# EAGLE design board (EAGLE 9.6.2)

## Sheet 1 of 2
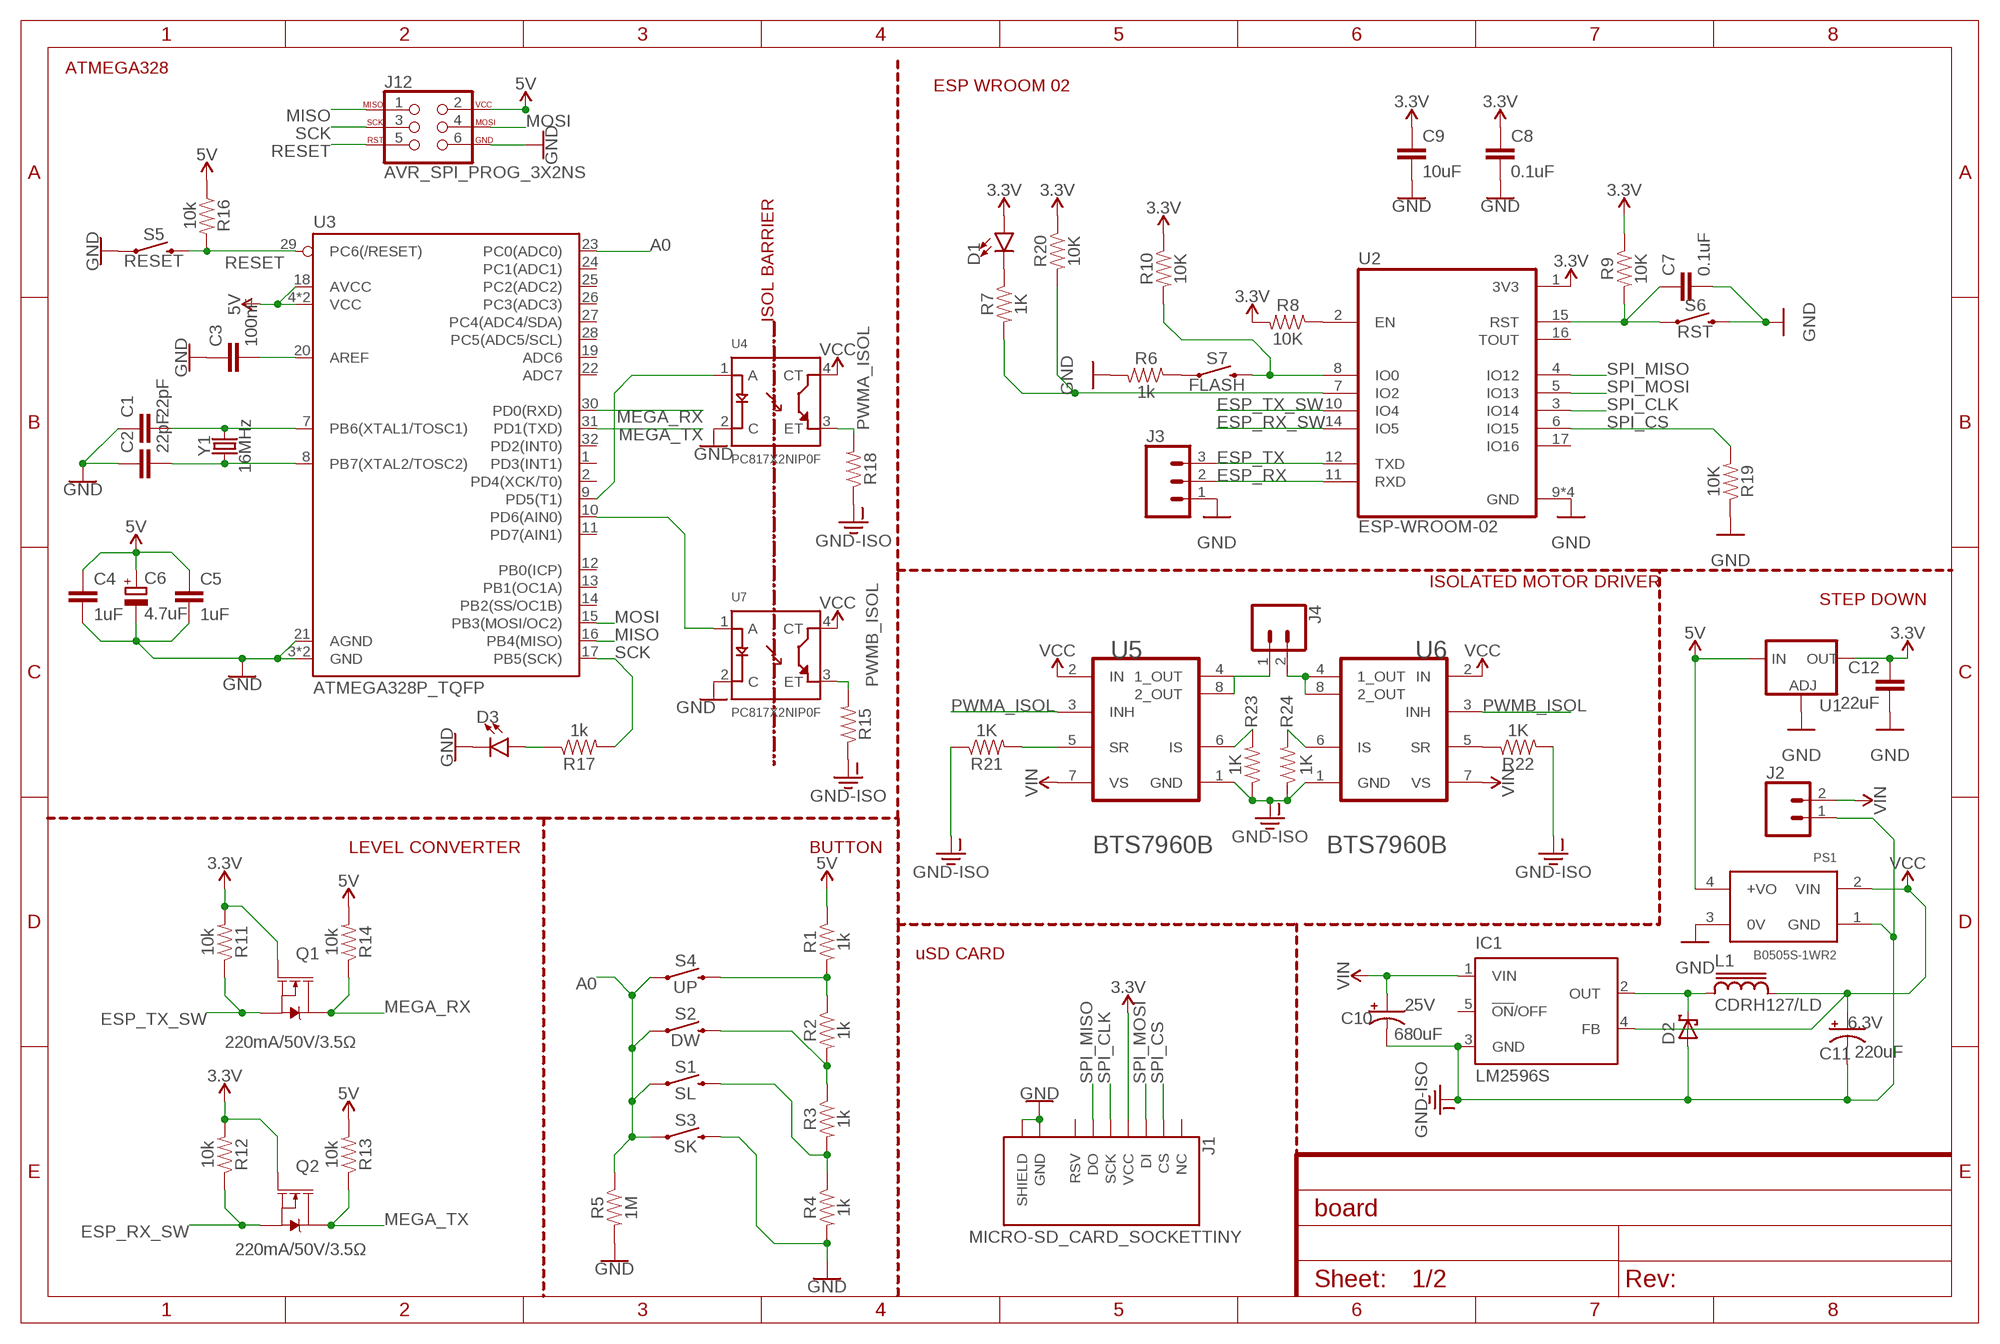
[diagram p0: schematic, sheet 1]

### Parts
C1  22pF  22PF-0603-50V-5%  [0603]
C2  22pF  22PF-0603-50V-5%  [0603]
C3  100nF  C-EUC0805  [C0805]
C4  1uF  C-EUC0805  [C0805]
C5  1uF  C-EUC0805  [C0805]
C6  4.7uF  CPOL-EUUD-4X5,8  [UD-4X5,8_NICHICON]
C7  0.1uF  0.1UF-0603-25V-5%  [0603]
C8  0.1uF  0.1UF-0603-25V-5%  [0603]
C9  10uF  0.1UF-0603-25V-5%  [0603]
C10  680uF  CPOL-USE5-10.5  [E5-10,5]
C11  220uF  CPOL-USUD-6,3X5,8  [UD-6,3X5,8_NICHICON]
C12  22uF  22UF-0805-6.3V-20%  [0805]
D1  LED1206  [LED-1206]
D2  SCHOTTKY-DIODESMD  [SMB]
D3  LED1206  [LED-1206]
IC1  LM2596S  [TO263-5]
J1  MICRO-SD_CARD_SOCKETTINY  [MICROSD_TINY]
J2  CONN_025MM  [SCREWTERMINAL-5MM-2]
J3  CONN_03POLAR  [MOLEX-1X3]
J4  CONN_025MM  [SCREWTERMINAL-5MM-2]
J12  AVR_SPI_PROG_3X2NS  [2X3-NS]
L1  CDRH127/LD  [CDRH127/LD]
PS1  B0505S-1WR2  [CONV_B0505S-1WR2]
Q1  220mA/50V/3.5Ω  MOSFET-NCH-BSS138  [SOT23-3]
Q2  220mA/50V/3.5Ω  MOSFET-NCH-BSS138  [SOT23-3]
R1  1k  RESISTOR1206  [1206]
R2  1k  RESISTOR1206  [1206]
R3  1k  RESISTOR1206  [1206]
R4  1k  RESISTOR1206  [1206]
R5  1M  RESISTOR1206  [1206]
R6  1k  RESISTOR1206  [1206]
R7  1K  RESISTOR1206  [1206]
R8  10K  RESISTOR1206  [1206]
R9  10K  RESISTOR1206  [1206]
R10  10K  RESISTOR1206  [1206]
R11  10k  RESISTOR1206  [1206]
R12  10k  RESISTOR1206  [1206]
R13  10k  RESISTOR1206  [1206]
R14  10k  RESISTOR1206  [1206]
R15  RESISTOR1206  [1206]
R16  10k  RESISTOR1206  [1206]
R17  1k  RESISTOR1206  [1206]
R18  RESISTOR1206  [1206]
R19  10K  RESISTOR1206  [1206]
R20  10K  RESISTOR1206  [1206]
R21  1K  RESISTOR1206  [1206]
R22  1K  RESISTOR1206  [1206]
R23  1K  RESISTOR1206  [1206]
R24  1K  RESISTOR1206  [1206]
S1  SL  MOMENTARY-SWITCH-SPST-SMD-5.2-REDUNDANT  [TACTILE_SWITCH_SMD_5.2MM]
S2  DW  MOMENTARY-SWITCH-SPST-SMD-5.2-REDUNDANT  [TACTILE_SWITCH_SMD_5.2MM]
S3  SK  MOMENTARY-SWITCH-SPST-SMD-5.2-REDUNDANT  [TACTILE_SWITCH_SMD_5.2MM]
S4  UP  MOMENTARY-SWITCH-SPST-SMD-5.2-REDUNDANT  [TACTILE_SWITCH_SMD_5.2MM]
S5  RESET  MOMENTARY-SWITCH-SPST-SMD-5.2-REDUNDANT  [TACTILE_SWITCH_SMD_5.2MM]
S6  RST  MOMENTARY-SWITCH-SPST-SMD-5.2-REDUNDANT  [TACTILE_SWITCH_SMD_5.2MM]
S7  FLASH  MOMENTARY-SWITCH-SPST-SMD-5.2-REDUNDANT  [TACTILE_SWITCH_SMD_5.2MM]
U1  V_REG_LM1117SOT223  [SOT223]
U2  ESP-WROOM-02  [MODULE_ESP-WROOM-02]
U3  ATMEGA328P_TQFP  [TQFP32-08]
U4  PC817X2NIP0F  [SOT254P975X400-4N]
U5  INFINEON_BTS7960BINFINEON_BTS7960B_0_2  [INFINEON_BTS7960B_2]
U6  INFINEON_BTS7960BINFINEON_BTS7960B_0_2  [INFINEON_BTS7960B_2]
U7  PC817X2NIP0F  [SOT254P975X400-4N]
Y1  16MHz  CRYSTALPTH-HC49US  [HC49US]

### Nets
3.3V: C8.1 C9.1 C12.1 D1.A J1.4(VCC) Q1.1(G) Q2.1(G) R8.2 R9.1 R10.1 R11.2 R12.2 R20.1 U1.2(OUT) U1.4(OUT) U2.1(3V3)
5V: C4.1 C5.1 C6.+ J12.2 PS1.4(+VO) R1.1 R13.2 R14.2 R16.1 U1.3(IN) U3.4(VCC) U3.6(VCC) U3.18(AVCC)
A0: R5.1 S1.1 S1.2 S2.1 S2.2 S3.1 S3.2 S4.1 S4.2 U3.23(PC0(ADC0))
ESP_RX: J3.2 U2.11(RXD)
ESP_RX_SW: Q2.2(S) R12.1 U2.14(IO5)
ESP_TX: J3.3 U2.12(TXD)
ESP_TX_SW: Q1.2(S) R11.1 U2.10(IO4)
GND: C1.1 C2.1 C3.1 C4.2 C5.2 C6.- C7.2 C8.2 C9.2 C12.2 D3.C J1.6(GND) J1.GND1(SHIELD) J1.GND2(SHIELD) J1.GND3(SHIELD) J1.GND4(SHIELD) J1.GND5(SHIELD) J1.GND6(SHIELD) J3.1 J12.6 PS1.3(0V) R4.2 R5.2 R6.2 R19.1 S3.3 S3.4 S5.1 S5.2 S6.3 S6.4 U1.1(ADJ) U2.9(GND) U2.13(GND) U2.18(GND) U2.19(GND) U3.3(GND) U3.5(GND) U3.21(AGND) U4.2(C) U7.2(C)
GND-ISO: C10.- C11.- D2.A IC1.3(GND) J2.1 PS1.1(GND) R15.1 R18.1 R21.1 R22.2 R23.1 R24.1 U5.1(GND) U6.1(GND)
MEGA_RX: Q1.3(D) R14.1 U3.30(PD0(RXD))
MEGA_TX: Q2.3(D) R13.1 U3.31(PD1(TXD))
MISO: J12.1 U3.16(PB4(MISO))
MOSI: J12.4 U3.15(PB3(MOSI/OC2))
N$1: C1.2 U3.7(PB6(XTAL1/TOSC1)) Y1.2
N$2: C2.2 U3.8(PB7(XTAL2/TOSC2)) Y1.1
N$3: R2.2 R3.1 S2.3 S2.4
N$4: R3.2 R4.1 S1.3 S1.4
N$5: R1.2 R2.1 S4.3 S4.4
N$7: R23.2 U5.6(IS)
N$8: C7.1 R9.2 S6.1 S6.2 U2.15(RST)
N$9: R24.2 U6.6(IS)
N$10: R10.2 S7.3 S7.4 U2.8(IO0)
N$11: R6.1 S7.1 S7.2
N$12: J4.1 U5.4(1_OUT) U5.8(2_OUT)
N$13: D1.C R7.1
N$14: R8.1 U2.2(EN)
N$21: J4.2 U6.4(1_OUT) U6.8(2_OUT)
N$22: R21.2 U5.5(SR)
N$23: R7.2 R20.2 U2.7(IO2)
N$24: R22.1 U6.5(SR)
N$42: D3.A R17.1
N$43: C3.2 U3.20(AREF)
OUT: D2.C IC1.2(OUT) L1.1
PWMA: U3.9(PD5(T1)) U4.1(A)
PWMA_ISOL: R18.2 U4.3(ET) U5.3(INH)
PWMB: U3.10(PD6(AIN0)) U7.1(A)
PWMB_ISOL: R15.2 U6.3(INH) U7.3(ET)
RESET: J12.5 R16.2 S5.3 S5.4 U3.29(PC6(/RESET))
SCK: J12.3 R17.2 U3.17(PB5(SCK))
SPI_CLK: J1.5(SCK) U2.3(IO14)
SPI_CS: J1.2(CS) R19.2 U2.6(IO15)
SPI_MISO: J1.7(DO) U2.4(IO12)
SPI_MOSI: J1.3(DI) U2.5(IO13)
VCC: C11.+ IC1.4(FB) L1.2 PS1.2(VIN) U4.4(CT) U5.2(IN) U6.2(IN) U7.4(CT)
VIN: C10.+ IC1.1(VIN) J2.2 U5.7(VS) U6.7(VS)
Unconnected: IC1.5(!ON!/OFF) J1.1(RSV) J1.8(RSV) J1.9(NC) U2.16(TOUT) U2.17(IO16) U3.1(PD3(INT1)) U3.2(PD4(XCK/T0)) U3.11(PD7(AIN1)) U3.12(PB0(ICP)) U3.13(PB1(OC1A)) U3.14(PB2(SS/OC1B)) U3.19(ADC6) U3.22(ADC7) U3.24(PC1(ADC1)) U3.25(PC2(ADC2)) U3.26(PC3(ADC3)) U3.27(PC4(ADC4/SDA)) U3.28(PC5(ADC5/SCL)) U3.32(PD2(INT0))

### Notes on the sheet
- ATMEGA328
- ESP WROOM 02
- ISOL BARRIER
- ISOLATED MOTOR DRIVER
- STEP DOWN
- LEVEL CONVERTER | BUTTON
- uSD CARD

## Sheet 2 of 2

## Library data of the parts
C1 C2 = SparkFun-Capacitors:22PF: 22pF ceramic capacitors A capacitor is a passive two-terminal electrical component used to store electrical energy temporarily in an electric field.; PROD_ID: CAP-07876
C3-C5 = rcl:C-EU: CAPACITOR, European symbol; SPICEPREFIX: C
C6 = rcl:CPOL-EU: POLARIZED CAPACITOR, European symbol; SPICEPREFIX: C
C7 C8 = SparkFun-Capacitors:0.1UF: 0.1µF ceramic capacitors A capacitor is a passive two-terminal electrical component used to store electrical energy temporarily in an electric field.; PROD_ID: CAP-08604
C9 = SparkFun-Capacitors:0.1UF: 0.1µF ceramic capacitors A capacitor is a passive two-terminal electrical component used to store electrical energy temporarily in an electric field.; PROD_ID: CAP-08604; VALUE: 0.1uF
C10 = rcl:CPOL-US: POLARIZED CAPACITOR, American symbol; VOLTAGE: 25V
C11 = rcl:CPOL-US: POLARIZED CAPACITOR, American symbol; VOLTAGE: 6.3V
C12 = SparkFun-Capacitors:22UF: 22µF ceramic capacitors A capacitor is a passive two-terminal electrical component used to store electrical energy temporarily in an electric field.; PROD_ID: CAP-08402
D1 D3 = SparkFun-LED:LED: LED (Generic) Standard schematic elements and footprints for 5mm, 3mm, 1206, and 0603 sized LEDs. Generic LEDs with no color specified.
D2 = diode:SCHOTTKY-DIODE: Schottky Diode
IC1 = national-semiconductor:LM2596: SIMPLE SWITCHER® Power Converter 150 kHz 3A Step-Down Voltage Regulator Source: http://www.national.com/ds/LM/LM2596.pdf; MF: NATIONAL SEMICONDUCTOR; MPN: LM2596S-ADJ/NOPB; OC_FARNELL: 9494367; OC_NEWARK: 41K3842
J1 = SparkFun-Connectors:MICRO-SD_CARD_SOCKET: microSD Socket for Transflash Push-push type µSD socket. tDoc lines correctly indicate media card edge positions when inserting (unlocked, locked, depressed). NOTE: CD1 and CD2 are connected internally, and the default detect state of the socket is detect pin to ground. SparkFun Products: WAV Trigger <https://www.sparkfun.com/products/13660> CAN-Bus Shield <https://www.sparkfun.com/products/13262> SparkFun Level Shifing microSD Breakout <https://www.sparkfun.com/products/13743>; PROD_ID: CONN-13500
J2 J4 = SparkFun-Connectors:CONN_02: Multi connection point. Often used as Generic Header-pin footprint for 0.1 inch spaced/style header connections On any of the 0.1 inch spaced packages, you can populate with these: Break Away Headers - Straight <https://www.sparkfun.com/products/116> (PRT-00116) Break Away Male Headers - Right Angle <https://www.sparkfun.com/products/553> (PRT-00553) Female Headers <https://www.sparkfun.com/products/115> (PRT-00115) Break Away Headers - Machine Pin <https://www.sparkfun.com/products/117> (PRT-00117) Break Away Female Headers - Swiss Machine Pin <https://www.sparkfun.com/products/743> (PRT-00743) For SCREWTERMINALS and SPRING TERMINALS visit here: Screw Terimnals on SparkFun.com <https://www.sparkfun.com/search/results?term=Screw+Terminals> (5mm/3.5mm/2.54mm spacing) This device is also useful as a general connection point to wire up your design to another part of your project. Our various solder wires solder well into these plated through hole pads. Hook-Up Wire - Assortment (Stranded, 22 AWG) <https://www.sparkfun.com/products/11375> (PRT-11375) Hook-Up Wire - Assortment (Solid Core, 22 AWG) <https://www.sparkfun.com/products/11367> (PRT-11367) View the entire wire category on our website here <https://www.sparkfun.com/categories/141> Special notes: Molex polarized connector foot print use with: PRT-08233 with associated crimp pins and housings. 2.54_SCREWTERM for use with PRT-10571. 3.5mm Screw Terminal footprints for PRT-08084 5mm Screw Terminal footprints for use with PRT-08432; SF_SKU: PRT-08432
J3 = SparkFun-Connectors:CONN_03: Multi connection point. Often used as Generic Header-pin footprint for 0.1 inch spaced/style header connections On any of the 0.1 inch spaced packages, you can populate with these: Break Away Headers - Straight <https://www.sparkfun.com/products/116> (PRT-00116) Break Away Male Headers - Right Angle <https://www.sparkfun.com/products/553> (PRT-00553) Female Headers <https://www.sparkfun.com/products/115> (PRT-00115) Break Away Headers - Machine Pin <https://www.sparkfun.com/products/117> (PRT-00117) Break Away Female Headers - Swiss Machine Pin <https://www.sparkfun.com/products/743> (PRT-00743) Stackable Header - 3 Pin (Female, 0.1") <https://www.sparkfun.com/products/13875> (PRT-13875) For SCREWTERMINALS and SPRING TERMINALS visit here: Screw Terimnals on SparkFun.com <https://www.sparkfun.com/search/results?term=Screw+Terminals> (5mm/3.5mm/2.54mm spacing) This device is also useful as a general connection point to wire up your design to another part of your project. Our various solder wires solder well into these plated through hole pads. Hook-Up Wire - Assortment (Stranded, 22 AWG) <https://www.sparkfun.com/products/11375> (PRT-11375) Hook-Up Wire - Assortment (Solid Core, 22 AWG) <https://www.sparkfun.com/products/11367> (PRT-11367) View the entire wire category on our website here <https://www.sparkfun.com/categories/141> Special notes: Molex polarized connector foot print use with SKU : PRT-08232 with associated crimp pins and housings.; PROD_ID: CONN-08625; SF_ID: PRT-08096
J12 = SparkFun-Connectors:AVR_SPI_PROG_3X2: AVR ISP 6 Pin This is the reduced ISP connector for AVR programming. Common on Arduino. This footprint will take up less PCB space and can be used with a 10-pin to 6-pin adapter such as SKU: BOB-08508 **Special note about "TEST_POINT" package. The stop mask is on the top side, so if you want your programming test points to be on the bottom of your board, make sure to place this package on the bottom side of the board. This also ensure that the orientation to program from the bottom side will be correct. SparkFun Products: SparkFun ISP Pogo Adapter <https://www.sparkfun.com/products/11591> - NS Tiny AVR Programmer <https://www.sparkfun.com/products/11801> -PTH
L1 = inductor-sumida:CDRH127/LD: Power Inductor
PS1 = B0505S-1WR2:B0505S-1WR2: 1W isolated DC-DC with Fixed Input Voltage; unregulated Single Output Buy Part <https://snapeda.com/parts/B0505S-1WR2/MORNSUN/view-part/?ref=eda>; AVAILABILITY: Warning; DESCRIPTION: 1W isolated DC-DC with Fixed Input Voltage; unregulated Single Output; MF: MORNSUN; MP: B0505S-1WR2; PACKAGE: None; PRICE: None
Q1 Q2 = SparkFun-DiscreteSemi:MOSFET-NCH: N-channel MOSFETs Voltage controlled devices that allow control of high current outputs. SparkFun Products: SparkFun OpenScale <https://www.sparkfun.com/products/13261> SparkFun Digital Sandbox <https://www.sparkfun.com/products/12651> SparkFun Monster Moto Shield <https://www.sparkfun.com/products/10182> SparkFun MOSFET Power Controller <https://www.sparkfun.com/products/11214>; PROD_ID: TRANS-00830
R1-R24 = SparkFun-Resistors:RESISTOR: Generic Resistor Package
S1-S7 = SparkFun-Switches:MOMENTARY-SWITCH-SPST: Momentary Switch (Pushbutton) - SPST Normally-open (NO) SPST momentary switches (buttons, pushbuttons). Variants PTH-12MM - 12mm square, through-hole Momentary Pushbutton Switch - 12mm Square <https://www.sparkfun.com/products/9190> (COM-09190) PTH-6.0MM, PTH-6.0MM-KIT - 6.0mm square, through-hole Mini Pushbutton Switch <https://www.sparkfun.com/products/97> (COM-00097) KIT package intended for soldering kit's - only one side of pads' copper is exposed. PTH-RIGHT-ANGLE-KIT - Right-angle, through-hole Right Angle Tactile Button <https://www.sparkfun.com/products/10791> - Used on SparkFun BigTime Watch Kit <https://www.sparkfun.com/products/11734> SMD-12MM - 12mm square, surface-mount Tactile Button - SMD (12mm) <https://www.sparkfun.com/products/12993> (COM-12993) Used on SparkFun PicoBoard <https://www.sparkfun.com/products/11888> SMD-4.5MM - 4.5mm Square Trackball Switch Used on SparkFun Blackberry Trackballer Breakout <https://www.sparkfun.com/products/13169> SMD-4.6MMX2.8MM - 4.60mm x 2.80mm, surface mount Used on SparkFun SAMD21 Mini Breakout <https://www.sparkfun.com/products/13664> SMD-5.2MM, SMD-5.2-REDUNDANT - 5.2mm square, surface-mount Mini Pushbutton Switch - SMD <https://www.sparkfun.com/products/8720> (COM-08720) Used on Arduino Pro Mini <https://www.sparkfun.com/products/11114> REDUNDANT package connects both switch circuits together SMD-6.0X3.5MM - 6.0 x 3.5mm, surface mount Momentary Reset Switch SMD <https://www.sparkfun.com/products/8229> (COM-08229) SMD-6.2MM-TALL - 6.2mm square, surface mount Tactile Button - SMD (6mm) <https://www.sparkfun.com/products/12992> Used on SparkFun Digital Sandbox <https://www.sparkfun.com/products/12651> SMD-RIGHT-ANGLE - Right-angle, surface mount Used on SparkFun Block for Intel® Edison - Arduino <https://www.sparkfun.com/products/13036>; PROD_ID: SWCH-08247; SF_SKU: COM-08720
U1 = SparkFun-IC-Power:V_REG_LM1117: Voltage Regulator LM1117 Standard adjustable voltage regulator but in SMD form. Spark Fun Electronics SKU : COM-00595; PROD_ID: VREG-08170
U2 = ESP-WROOM-02:ESP-WROOM-02: Wi-Fi Module w/ESP8266 802.11b/g/n 20dBm 20x18x3mm; AVAILABILITY: Unavailable; DESCRIPTION: WiFi 802.11b/g/n Transceiver Module 2.4GHz ~ 2.5GHz Integrated, Trace Surface Mount; MF: Espressif Systems; MP: ESP-WROOM-02; PACKAGE: SMD-18 Espressif Systems; PRICE: None
U3 = SparkFun-IC-Microcontroller:ATMEGA328P_TQFP: Popular 328P in QFP Storefront component: ATmega328 - TQFP <https://www.sparkfun.com/products/13448> (COM-13448) Datasheet <http://www.sparkfun.com/datasheets/Components/SMD/ATMega328.pdf> SparkFun Products SparkFun RedBoard - Programmed with Arduino <https://www.sparkfun.com/products/12757> (DEV-12757) Arduino Pro Mini 328 - 5V/16MHz <https://www.sparkfun.com/products/11113> (DEV-11113) Arduino Pro Mini 328 - 3.3V/8MHz <https://www.sparkfun.com/products/11114> (DEV-11114) SparkFun OpenLog <https://www.sparkfun.com/products/13712> (DEV-13712) SparkFun MicroView - OLED Arduino Module <https://www.sparkfun.com/products/12923> (DEV-12923) SparkFun Digital Sandbox <https://www.sparkfun.com/products/12651> (DEV-12651) SparkFun PicoBoard <https://www.sparkfun.com/products/11888> (WIG-11888) Arduino Fio <https://www.sparkfun.com/products/10116> (DEV-10116) LilyPad Arduino 328 Main Board <https://www.sparkfun.com/products/13342> (DEV-13342) SparkFun RedStick <https://www.sparkfun.com/products/13741> (DEV-13741) LilyPad MP3 <https://www.sparkfun.com/products/11013> (DEV-11013) LilyPad Arduino SimpleSnap <https://www.sparkfun.com/products/10941> (DEV-10941) SparkFun Stepoko <https://www.sparkfun.com/products/13899> (ROB-13899) SparkFun Geiger Counter <https://www.sparkfun.com/products/11345> (SEN-11345) SparkFun EL Sequencer <https://www.sparkfun.com/products/12781> (COM-12781) Arduino Pro 328 - 5V/16MHz <https://www.sparkfun.com/products/10915> (DEV-10915) CryptoCape <https://www.sparkfun.com/products/12773> (DEV-12773) SparkFun IR Thermometer Evaluation Board - MLX90614 <https://www.sparkfun.com/products/10740> (SEN-10740) SparkFun RedBot Mainboard <https://www.sparkfun.com/products/12097> (ROB-12097) Arduino Pro 328 - 3.3V/8MHz <https://www.sparkfun.com/products/10914> (DEV-10914) SparkFun Block for Intel® Edison - Arduino <https://www.sparkfun.com/products/13036> (DEV-13036) SparkFun Simon Says - Surface Mount Soldering Kit <https://www.sparkfun.com/products/10935> (KIT-10935) SparkFun 7-Segment Serial Display - Red <https://www.sparkfun.com/products/11441> (COM-11441) SparkFun 7-Segment Serial Display - White <https://www.sparkfun.com/products/11629> (COM-11629) SparkFun 7-Segment Serial Display - Yellow <https://www.sparkfun.com/products/11443> (COM-11443) SparkFun 7-Segment Serial Display - Kelly Green <https://www.sparkfun.com/products/11440> (COM-11440) SparkFun 7-Segment Serial Display - Blue <https://www.sparkfun.com/products/11442> (COM-11442) SparkFun OpenSegment Serial Display - 20mm (Blue) <https://www.sparkfun.com/products/11647> (COM-11647) SparkFun OpenSegment Serial Display - 20mm (Green) <https://www.sparkfun.com/products/11646> (COM-11646) SparkFun OpenSegment Serial Display - 20mm (White) <https://www.sparkfun.com/products/11648> (COM-11648) SparkFun OpenSegment Serial Display - 20mm (Red) <https://www.sparkfun.com/products/11644> (COM-11644) SparkFun OpenSegment Serial Display - 20mm (Yellow) <https://www.sparkfun.com/products/11645> (COM-11645) SparkFun OpenSegment Shield <https://www.sparkfun.com/products/13190> (DEV-13190); PROD_ID: IC-09069
U4 U7 = PC817X2NIP0F:PC817X2NIP0F: PC817 Series 1 Channel 80 V 5000 Vrms General Purpose Photocoupler - DIP-4 Buy Part <https://snapeda.com/parts/PC817X2NIP0F/Sharp%20Microelectronics/view-part/?ref=eda>; AVAILABILITY: Bad; DESCRIPTION: Optoisolator Transistor Output 5000Vrms 1 Channel 4-SMD; MF: Sharp Microelectronics; MP: PC817X2NIP0F; PACKAGE: SMD-4 Sharp; PRICE: None
U5 U6 = Infineon - BTS7960B:INFINEON_BTS7960B: INF-BTS7960B-P-TO-263-7-8; CIIVA_IDS: 1433991; COMPONENT_LINK_1_DESCRIPTION: Manufacturer URL; COMPONENT_LINK_1_URL: http://www.infineon.com/; COMPONENT_LINK_3_DESCRIPTION: Package Specification; COMPONENT_LINK_3_URL: http://www.infineon.com/dgdl/BTS7970B_Datasheet.pdf?folderId=db3a304412b407950112b408e8c90004&fileId=db3a304412b407950112b43949b36d61&sId=db3a30433d68e984013d7db637dc5e6a; DATASHEET: http://www.infineon.com/dgdl/BTS7960_Datasheet.pdf?folderId=db3a304412b407950112b408e8c90004&fileId=db3a304412b407950112b43945006d5d&location=en.Products.Automotive_ICs.Motor_Drivers__Automotive_.Integrated_High_Current_Motor_Drivers__NovalithIC____Trilith; DATASHEET_VERSION: Rev. 1.1; FOOTPRINT_VARIANT_NAME_0: Level C; FOOTPRINT_VARIANT_NAME_1: Level B; FOOTPRINT_VARIANT_NAME_2: Level A; GREEN: false; HALOGEN_FREE: false; IMPORTED: yes; IMPORTED_FROM: vault; IMPORT_TS: 1521847212; IQ_TYP: 7 uA; MF: Infineon; MOUNTING_TECHNOLOGY: Surface Mount; MPN: BTS7960B; PACKAGE: P-TO-263-7-6; PACKAGE_DESCRIPTION: 7-Pin Plastic Transistor Single Outline Package, 9.9 x 9.2 mm Body, 1.27 mm Pitch; PACKAGE_VERSION: May-06; PREFIX: U; RELEASE_DATE: 1409251876; VAULT_GUID: B393A870-FA2E-4B9F-B354-86DE587E5000; VAULT_REVISION: 0F038138-080F-44BA-A129-3EB9BCBF95C1
Y1 = SparkFun-Clocks:CRYSTAL: Crystals (Generic) These are passive quartz crystals, which can be used as a clock source for a microcontroller. Crystal's are two-terminal devices. They require external "load" capacitors to generate an oscillating signal.

## Board
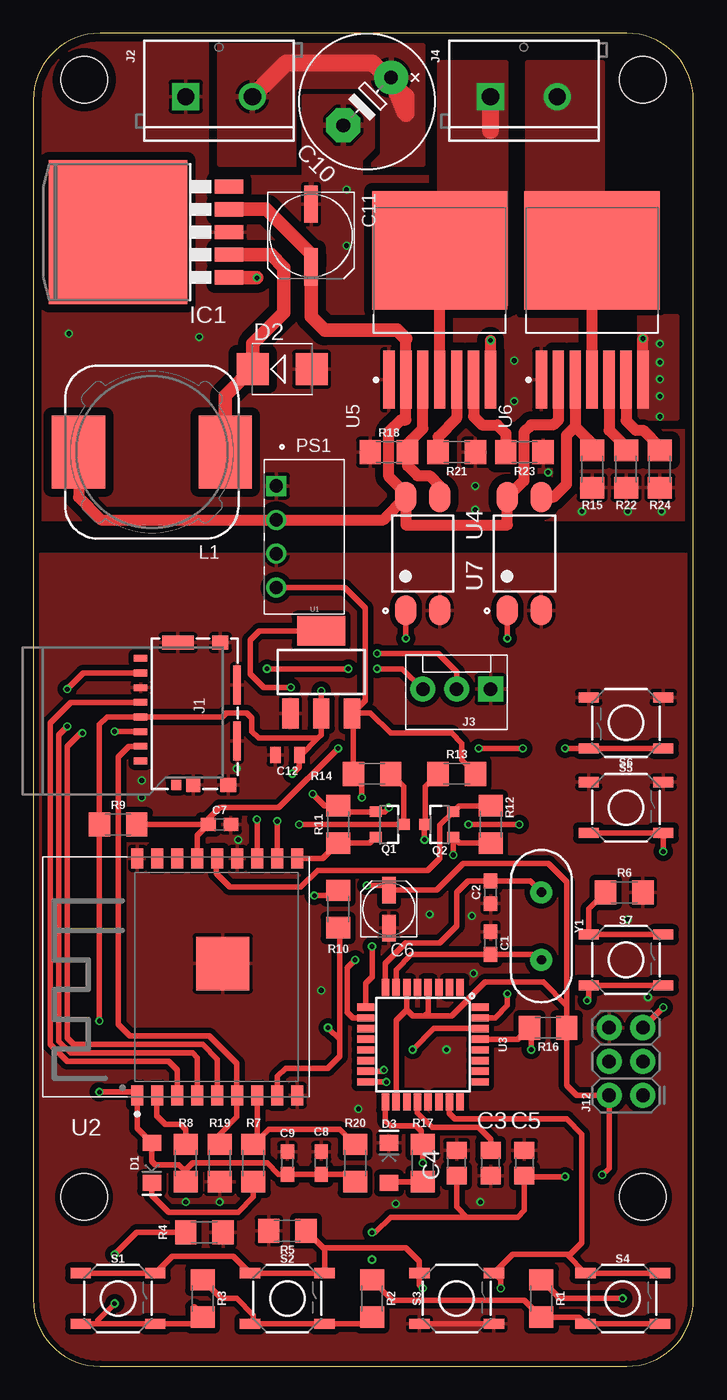
[diagram p1: board, top side]
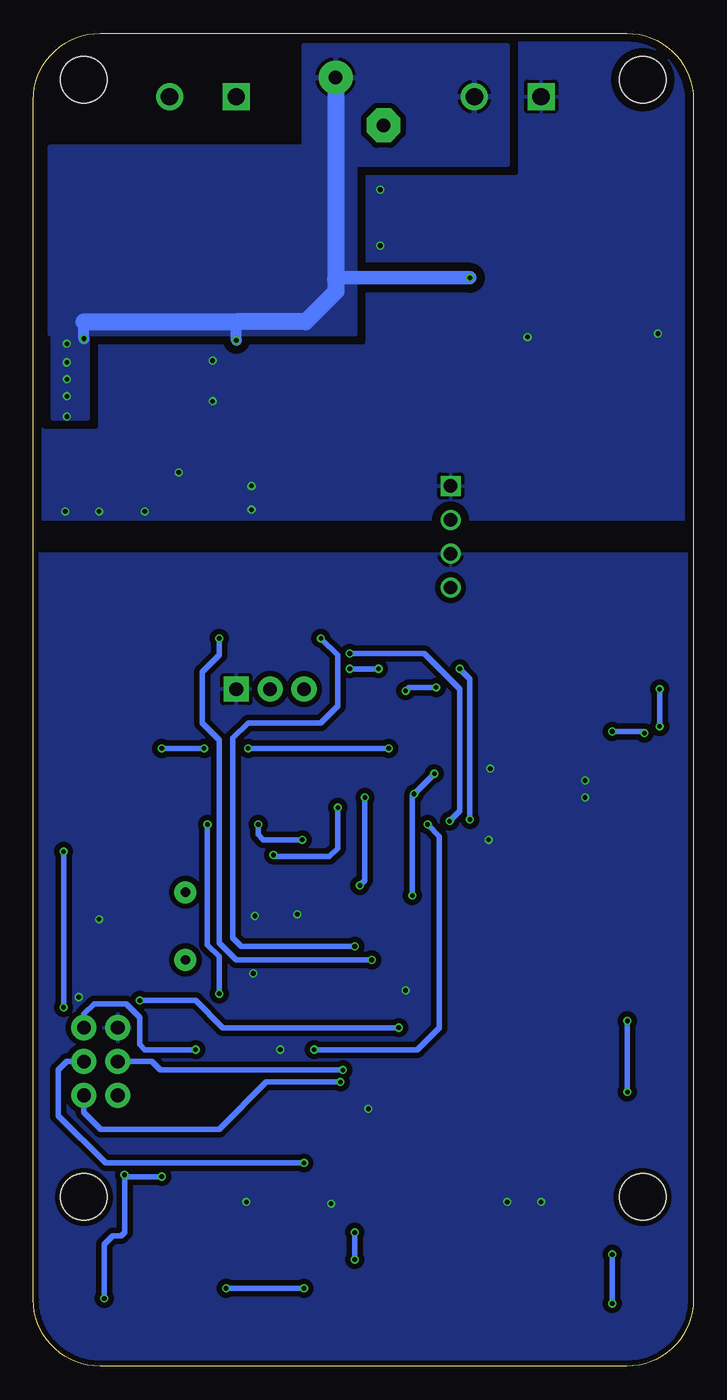
[diagram p2: board, bottom side, seen from below]

Size 49.51 x 100 mm. Coordinates in mm from the lower left corner, seen from the top.
Outline: 44.51,100 5,100 arc90 0,95 0,5 arc90 5,0 44.51,0 arc90 49.51,5 49.51,95 arc90 44.51,100
Copper layers (1*16): Top 0.0356mm / dielectric 1.5011mm / Bottom 0.0356mm
Design rules "ohs-park-2-layer": minimum track width 6mil, minimum drill 10mil, track to track 6mil, track to pad 6mil, pad to pad 6mil, via to via 6mil, smd to smd 6mil, copper to edge 15mil, drill to drill 6mil, minimum pad ring 5mil, minimum via ring 5mil, stop-mask expansion 4mil, vias tented up to drill 100mil, thermal gap 10mil
Holes 3.5 mm at 3.81,12.7 45.72,12.7 3.81,96.52 45.72,96.52

### Footprints (pad centres in the part's own frame; a part is rotated, then mirrored left to right if it is on the bottom)
0603 = smd 1.1 x 1: 1 -0.85,0; 2 0.85,0
C0805 = smd 1.3 x 1.5: 1 -0.95,0; 2 0.95,0
UD-4X5,8_NICHICON = smd 2 x 1: + 1.425,0; - -1.425,0
E5-10,5 = drill 1.016 pad 2.54: + -2.54,0 | drill 1.016 pad 2.54 octagon: - 2.54,0
UD-6,3X5,8_NICHICON = smd 2.8 x 1: + 2.35,0; - -2.35,0
0805 = smd 0.8 x 1.2: 1 -0.9,0; 2 0.9,0
LED-1206 = smd 1.2 x 1.4: A -1.5,0; C 1.5,0
SMB = smd 2.4 x 2.4: A 2.2,0; C -2.2,0
TO263-5 = smd 1.067 x 2.159: 1 -3.404,-5.791; 2 -1.702,-5.791; 3 0,-5.791; 4 1.702,-5.791; 5 3.404,-5.791 | smd 10.8 x 10.41: 6 0,2.54
MICROSD_TINY = smd 0.5 x 1: 1 9.2,-0.85; 2 8.1,-0.85; 3 7,-0.85; 4 5.9,-0.85; 5 4.8,-0.85; 6 3.7,-0.85; 7 2.6,-0.85; 8 1.5,-0.85 | smd 0.72 x 0.78: 9 11,1.83 | smd 1.05 x 1.08: GND1 11,3.1 | smd 1.05 x 1.2: GND2 11,5.71; GND3 0.325,5.14 | smd 1.05 x 2.39: GND4 0.325,1.955 | smd 2.91 x 0.55: GND5 3.505,6.385; GND6 7.695,6.385
SCREWTERMINAL-5MM-2 = drill 1.3 pad 2.032 square: 1 0,0 | drill 1.3 pad 2.032: 2 5,0
MOLEX-1X3 = drill 1.016 pad 1.88 square: 1 0,0 | drill 1.016 pad 1.88: 2 2.54,0; 3 5.08,0
2X3-NS = drill 1.016 pad 1.88: 1 -2.54,-1.27; 2 -2.54,1.27; 3 0,-1.27; 4 0,1.27; 5 2.54,-1.27; 6 2.54,1.27
CDRH127/LD = smd 4 x 5.5: 1 -5.5,0; 2 5.5,0
CONV_B0505S-1WR2 = drill 1 square: 1 -3.81,-2.1 | drill 1: 2 -1.27,-2.1; 3 1.27,-2.1; 4 3.81,-2.1
SOT23-3 = smd 0.8 x 0.9: 1 -0.95,-1; 2 0.95,-1; 3 0,1.1
1206 = smd 1.6 x 1.8: 1 -1.4,0; 2 1.4,0
TACTILE_SWITCH_SMD_5.2MM = smd 1.524 x 0.762: 1 -2.794,1.905; 2 2.794,1.905; 3 -2.794,-1.905; 4 2.794,-1.905
SOT223 = smd 1.219 x 2.235: 1 -2.311,-3.099; 2 0,-3.099; 3 2.311,-3.099 | smd 3.6 x 2.2: 4 0,3.099
MODULE_ESP-WROOM-02 = smd 1.485 x 0.9: 1 -8.893,4.9; 2 -8.893,3.4; 3 -8.893,1.9; 4 -8.893,0.4; 5 -8.893,-1.1; 6 -8.893,-2.6; 7 -8.893,-4.1; 8 -8.893,-5.6; 9 -8.893,-7.1; 10 8.893,-7.1; 11 8.893,-5.6; 12 8.893,-4.1; 13 8.893,-2.6; 14 8.893,-1.1; 15 8.893,0.4; 16 8.893,1.9; 17 8.893,3.4; 18 8.893,4.9 | smd 4 x 4: 19 1,-1.5
TQFP32-08 = smd 1.27 x 0.559: 1 -4.293,2.8; 2 -4.293,2; 3 -4.293,1.2; 4 -4.293,0.4; 5 -4.293,-0.4; 6 -4.293,-1.2; 7 -4.293,-2; 8 -4.293,-2.8; 17 4.293,-2.8; 18 4.293,-2; 19 4.293,-1.2; 20 4.293,-0.4; 21 4.293,0.4; 22 4.293,1.2; 23 4.293,2; 24 4.293,2.8 | smd 0.559 x 1.27: 9 -2.8,-4.293; 10 -2,-4.293; 11 -1.2,-4.293; 12 -0.4,-4.293; 13 0.4,-4.293; 14 1.2,-4.293; 15 2,-4.293; 16 2.8,-4.293; 25 2.8,4.293; 26 2,4.293; 27 1.2,4.293; 28 0.4,4.293; 29 -0.4,4.293; 30 -1.2,4.293; 31 -2,4.293; 32 -2.8,4.293
SOT254P975X400-4N = smd 2.25 x 1.6: 1 -4.25,1.27; 2 -4.25,-1.27; 3 4.25,-1.27; 4 4.25,1.27
INFINEON_BTS7960B_2 = smd 4.35 x 0.85: 1 -6,3.81; 2 -6,2.54; 3 -6,1.27; 4 -6,0; 5 -6,-1.27; 6 -6,-2.54; 7 -6,-3.81 | smd 8.9 x 10.15: 8 3.7,0
HC49US = drill 0.7 pad 1.651: 1 -2.54,0; 2 2.54,0

### Placement (x,y rotation side)
C1  34.29,31.75 270 top
C2  34.29,35.56 90 top
C3  34.29,15.24 90 top
C4  31.75,15.24 90 top
C5  36.83,15.24 90 top
C6  26.67,34.29 90 top
C7  13.97,40.64 0 top
C8  21.59,15.24 90 top
C9  19.05,15.24 90 top
C10  25.04,94.89 225 top
C11  20.83,84.84 270 top
C12  19.05,45.85 180 top
D1  8.89,15.24 270 top
D2  18.67,74.8 0 top
D3  26.67,15.24 90 top
IC1  8.89,85.09 90 top
J1  8.89,54.61 270 top
J2  11.43,95.25 0 top
J3  34.29,50.8 180 top
J4  34.29,95.25 0 top
J12  44.45,22.86 90 top
L1  8.89,68.58 180 top
PS1  20.32,62.23 270 top
Q1  26.67,40.64 270 top
Q2  30.48,40.64 90 top
R1  38.1,5.08 270 top
R2  25.4,5.08 270 top
R3  12.7,5.08 270 top
R4  12.83,10.03 0 top
R5  19.05,10.16 180 top
R6  44.32,35.56 0 top
R7  16.51,15.24 90 top
R8  11.43,15.24 270 top
R9  6.35,40.64 0 top
R10  22.86,34.29 270 top
R11  22.86,40.64 90 top
R12  34.29,40.64 270 top
R13  31.75,44.45 0 top
R14  25.4,44.45 180 top
R15  41.91,67.31 90 top
R16  38.61,25.4 180 top
R17  29.21,15.24 90 top
R18  26.67,68.58 0 top
R19  13.97,15.24 90 top
R20  24.13,15.24 90 top
R21  31.75,68.58 180 top
R22  44.45,67.31 270 top
R23  36.83,68.58 180 top
R24  46.99,67.31 90 top
S1  6.35,5.08 0 top
S2  19.05,5.08 0 top
S3  31.75,5.08 0 top
S4  44.2,5.08 0 top
S5  44.45,41.91 0 top
S6  44.45,48.26 180 top
S7  44.45,30.48 0 top
U1  21.59,52.07 0 top
U2  12.7,29.21 90 top
U3  29.21,24.13 270 top
U4  29.21,60.96 90 top
U5  30.48,80.01 90 top
U6  41.91,80.01 90 top
U7  36.83,60.96 90 top
Y1  38.1,33.02 270 top

### Tracks (layer width: path | path; a pad name or v marks a point on that pad's centre or on a via)
3.3V  (via drill 0.35)
  Top 0.406: R20.1 23.58,14.39 C8.1 C9.1 18.38,14.39 17.53,15.24 11.94,15.24 11.43,14.73 11.43,14.61 | R8.2 11.43,14.61 | 11.43,14.61 10.92,15.11 9.14,15.11 8.89,15.37 D1.A 7.8,17.83 U2.1 7.54,20.57 v4.95,20.57 | v4.95,25.91 R9.1 4.95,48.13 5.53,48.71 J1.4 14.17,48.71 14.48,49.02 16,49.02 16.38,48.64 16.38,47.62 16.89,47.12 21.35,47.12 | 21.35,47.12 21.59,47.36 U1.2 v21.59,50.67 | 21.35,47.12 20.08,45.85 C12.1 19.95,44.97 v19.43,44.45 | v20.95,42.93 21.84,42.04 R11.2 23.31,41.59 Q1.1 26.35,41.59 v26.67,41.91 | R12.2 31.93,39.24 Q2.1 31.5,39.67 v31.5,38.35 | R10.1 22.48,35.31 v21.08,35.31 | v19.3,50.93 17.27,50.93 16.26,51.94 16.26,54.48 16.94,55.17 U1.4
  Bottom 0.406: v4.95,25.91 v4.95,20.57 | v19.43,44.45 v20.95,42.93 21.08,42.8 v21.08,35.31 | v26.67,41.91 26.67,38.86 27.3,38.23 31.37,38.23 v31.5,38.35 | v21.59,50.67 21.34,50.93 v19.3,50.93
5V  (via drill 0.35)
  Top 0.406: U3.6 28.01,26.73 | 28.01,26.73 28.45,26.29 29.34,26.29 | U3.4 29.61,26.56 29.34,26.29 | U3.18 27.21,25.93 28.01,26.73 | 31.43,14.29 C4.1 31.75,11.94 32.51,11.18 | v25.4,10.03 25.65,10.03 26.8,11.18 32.51,11.18 | v42.67,14.35 43.18,14.86 J12.2 40.77,20.32 40.01,21.08 R16.1 40.01,27.05 | v39.88,14.22 36.83,14.22 C5.1 36.83,11.68 36.32,11.18 32.51,11.18 | 29.34,26.29 31.37,26.29 33.91,28.83 38.23,28.83 40.01,27.05 | PS1.4 23.37,58.42 24.89,56.9 24.89,49.96 U1.3 | U1.3 24,48.87 R14.2 24.64,43.81 v24.64,42.67 | R13.2 32.13,45.47 32.13,46.74 31.37,47.5 26.8,47.5 25.27,49.02 23.95,49.02 U1.3 | v25.02,36.07 26.32,36.07 C6.+ 30.25,35.72 32.26,37.72 38.61,37.72 40.01,36.32 40.01,27.05 | R1.1 39.37,5.21 39.37,5.08 v44.2,5.08
  Bottom 0.406: v25.4,8 v25.4,10.03 | v39.88,14.22 42.55,14.22 v42.67,14.35 42.67,10.03 42.93,9.78 43.56,9.78 44.2,9.14 v44.2,5.08 | v24.64,42.67 24.64,36.45 v25.02,36.07
A0  (via drill 0.35)
  Top 0.406: S1.1 S1.2 10.41,8.26 14.99,8.26 S2.1 S2.2 21.84,8.77 | 21.84,8.77 21.84,8.89 27.94,8.89 28.96,7.87 S3.1 28.96,6.1 v29.21,5.84 | 21.84,8.77 R5.1 | 40.01,8.38 S4.1 S4.2 | 40.01,8.38 35.94,8.38 S3.2 35.05,6.48 v35.05,5.84 | 40.01,8.38 40.26,8.38 41.15,9.27 41.15,17.4 40.01,18.54 31.62,18.54 31.21,18.95 U3.23
  Bottom 0.406: v29.21,5.84 v35.05,5.84
ESP_RX  (via drill 0.35)
  Top 0.406: U2.11 v18.3,40.88 v18.29,40.89 | v25.78,53.47 30.35,53.47 31.75,52.07 J3.2
  Bottom 0.406: v18.29,40.89 17.53,41.66 17.53,50.8 20.19,53.47 v25.78,53.47
ESP_RX_SW
  Top 0.406: R12.1 31.93,42.04 Q2.2 30.48,40.59 30.48,38.1 29.59,37.21 21.34,37.21 20.07,35.94 14.73,35.94 13.72,36.96 13.72,38.02 U2.14
ESP_TX  (via drill 0.35)
  Top 0.406: U2.12 16.8,40.98 v16.76,41.02 | v23.62,52.32 v17.53,52.32 | v25.78,52.32 27.69,52.32 J3.3
  Bottom 0.406: v16.76,41.02 16.76,51.56 v17.53,52.32 | v25.78,52.32 v23.62,52.32
ESP_TX_SW
  Top 0.406: U2.10 21.72,38.1 R11.1 25.22,39.24 Q1.2
GND  (via drill 0.35)
  Top 0.406: S3.3 S3.4
  other vias: 44.58,33.53 30.99,23.75 21.59,28.19 33.02,29.46 27.18,12.19 33.53,12.32 24.38,19.3 46.1,27.69 32.89,33.78 29.72,33.91 15.37,39.5 15.24,44.83 8.13,43.94 8.13,42.67 11.43,12.32 13.97,12.32
  pour Top (isolate 0.406): 0,60.96 49.53,60.96 49.53,-1.27 0,-1.27
  pour Bottom (isolate 0.406): 0,60.96 49.53,60.96 49.53,-1.27 0,-1.27
GND-ISO  (via drill 0.35)
  other vias: 41.15,64.14 44.58,64.14 47.12,64.14 33.15,66.04 33.15,64.26 36.07,75.44 36.07,72.39 23.5,88.27 23.5,84.07 12.45,77.22 2.67,77.47 38.61,67.06
  pour Top (isolate 0.61, rank 4): 0,63.5 49.53,63.5 49.53,101.6 0,101.6
  pour Bottom (isolate 0.61, rank 4): 0,63.5 49.53,63.5 49.53,101.6 0,101.6
  pour Top (isolate 0.406): 20.32,87.63 20.32,95.25 24,95.25 25.4,93.85 25.4,91.44 24.13,90.17 24.13,87.63
MEGA_RX  (via drill 0.35)
  Top 0.406: R14.1 27.77,43.48 Q1.3 v19.94,40.64 | U3.30 30.03,25.33 v28.45,23.75
  Bottom 0.406: v28.45,23.75 20.7,23.75 19.05,25.4 19.05,39.75 v19.94,40.64
MEGA_TX  (via drill 0.35)
  Top 0.406: R13.1 29.38,43.48 Q2.3 29.34,40.6 v29.34,39.5 | U3.31 34.64,26.13 35.56,27.05 v35.56,27.94 | v36.45,40.64 v32.64,40.64
  Bottom 0.406: v35.56,27.94 35.56,30.73 36.45,31.62 v36.45,40.64 | v32.64,40.64 32.64,39.88 32.26,39.5 v29.34,39.5
MISO  (via drill 0.35)
  Top 0.406: U3.16 26.46,21.33 v26.48,21.32
  Bottom 0.406: v26.48,21.32 32.02,21.32 35.56,17.78 44.45,17.78 45.72,19.05 J12.1
MOSI  (via drill 0.35)
  Top 0.406: U3.15 26.19,22.13 v26.29,22.23
  Bottom 0.406: v26.29,22.23 40.01,22.23 40.64,22.86 J12.4
N$1
  Top 0.406: Y1.2 38.1,30.52 37.72,30.9 C1.2 28.36,30.9 27.21,29.75 U3.7
N$2
  Top 0.406: Y1.1 37.25,36.41 C2.2 32.6,36.41 31.75,35.56 31.75,33.02 30.48,31.75 27.94,31.75 26.41,30.22 U3.8
N$3
  Top 0.406: R3.1 14.1,5.08 15.24,5.08 16.51,3.81 16.51,3.43 S2.3 S2.4 24.89,3.17 R2.2
N$4  (via drill 0.35)
  Top 0.406: S1.3 4.83,3.17 | 4.83,3.17 S1.4 12.06,3.17 12.7,3.81 12.06,4.45 12.06,4.32 R3.2 | R4.1 7.75,10.03 v6.1,8.38 | v6.1,4.7 4.83,3.43 4.83,3.17
  Bottom 0.406: v6.1,8.38 v6.1,4.7
N$5
  Top 0.406: R2.1 26.93,4.95 36.83,4.95 R1.2 40.9,3.68 S4.3 S4.4
N$7
  Top 0.813: U5.6 33.02,71.25 33.66,70.61 34.8,70.61 35.43,69.98 R23.2
N$8  (via drill 0.35)
  Top 0.406: U2.15 12.3,39.82 C7.1 | C7.1 R9.2 | C7.1 13.12,41.06 13.97,41.91 18.41,41.91 v22.86,46.35 | S6.1 S6.2 v39.88,46.35 | v33.4,46.35 v36.7,46.35
  Bottom 0.406: v22.86,46.35 v33.4,46.35 | v36.7,46.35 v39.88,46.35
N$9
  Top 0.813: U6.6 44.45,70.96 45.2,70.22 45.74,70.22 46.99,68.96 R24.2
N$10  (via drill 0.35)
  Top 0.406: S7.4 S7.3 41.66,27.56 v41.53,27.43 | U2.8 18.3,21.73 18.92,22.35 22.1,22.35 22.99,23.24 22.99,24.38 22.99,24.51 | 22.99,24.51 22.99,32.76 R10.2 | v22.1,25.4 22.99,24.51
  Bottom 0.406: v41.53,27.43 37.34,27.43 35.31,25.4 v22.1,25.4
N$11
  Top 0.406: S7.2 S7.1 41.66,34.29 R6.1
N$12
  Top 0.813: U5.4 U5.8 30.48,83.82
  Top 1.27: 34.29,92.71 J4.1
  pour Top (isolate 0.813, no thermals): 30.48,79.63 35.43,79.63 35.43,97.79 30.48,97.79
N$13
  Top 0.406: D1.C 8.89,12.83 10.16,11.56 15.37,11.56 16.51,12.7 R7.1
N$14
  Top 0.406: R8.1 11.43,17.78 11.05,18.16 9.91,18.16 9.27,18.8 9.27,20.29 U2.2
N$21
  Top 0.813: U6.4 U6.8 41.91,83.82
  pour Top (isolate 0.813, no thermals): 42.67,79.5 42.67,97.79 37.08,97.79 37.08,79.5
N$22
  Top 0.813: U5.5 31.75,71.12 30.35,69.72 R21.2
N$23
  Top 0.406: R20.2 22.99,17.78 17.65,17.78 R7.2 16.8,16.93 U2.7
N$24
  Top 0.813: U6.5 43.18,70.23 44.45,68.96 R22.1
N$42
  Top 0.406: 26.8,13.61 D3.A 26.77,13.84 R17.1
N$43
  Top 0.406: U3.20 28.81,19.01 29.91,17.91 33.4,17.91 34.29,17.02 C3.2
OUT
  Top 1.016: L1.1 14.39,72.81 16.38,74.8 D2.C 16.47,76.71 18.8,79.03 18.8,82.42 17.83,83.39 17.22,83.39 IC1.2
PWMA  (via drill 0.35)
  Top 0.406: U3.9 24.92,28.73 25.4,29.21 v25.4,31.5 | 27.94,57.15 U4.1 v27.94,54.61
  Bottom 0.406: v25.4,31.5 33.91,31.5 34.54,32.13 34.54,47.12 33.4,48.26 27.94,48.26 26.67,49.53 26.67,53.34 v27.94,54.61
PWMA_ISOL
  Top 0.813: U4.3 30.48,66.04 29.72,66.8 28.83,66.8 28.07,67.56 R18.2 28.07,69.22 29.21,70.36 U5.3
PWMB  (via drill 0.35)
  Top 0.406: U3.10 23.96,26.13 23.55,26.54 23.55,29.9 v24.13,30.48 | v35.56,54.61 U7.1
  Bottom 0.406: v24.13,30.48 34.29,30.48 35.56,31.75 35.56,46.99 36.83,48.26 36.83,52.07 35.56,53.34 v35.56,54.61
PWMB_ISOL
  Top 0.813: U6.3 40.64,70.48 | R15.2 41.91,69.22 40.64,70.48 | U7.3 39.05,65.21 40.01,66.17 40.01,69.85 40.64,70.48
RESET  (via drill 0.35)
  Top 0.406: U3.29 36.34,24.53 R16.2 37.34,25.27 v37.34,23.75 | S5.3 S5.4 v47.24,38.61 | J12.5 v47.24,26.92
  Bottom 0.406: v37.34,23.75 41.15,23.75 41.53,24.13 41.53,26.16 42.55,27.18 44.96,27.18 45.72,26.42 J12.5 | v47.24,26.92 v47.24,38.61
SCK  (via drill 0.35)
  Top 0.406: U3.17 26.41,18.42 26.8,18.03 28.7,18.03 29.08,17.65 29.08,16.77 R17.2 v29.21,15.24
  Bottom 0.406: J12.3 46.99,22.86 47.62,22.23 47.62,18.8 44.07,15.24 v29.21,15.24
SPI_CLK
  Top 0.406: U2.3 10.8,22.22 10.16,22.86 2.54,22.86 1.27,24.13 1.27,48.26 2.82,49.81 J1.5
SPI_CS
  Top 0.406: J1.2 7.14,46.51 6.35,45.72 6.35,25.65 7.24,24.77 13.21,24.77 15.26,22.71 15.26,20.36 | U2.6 15.26,20.36 | R19.2 13.97,17.4 15.26,18.69 15.26,20.36
SPI_MISO  (via drill 0.35)
  Top 0.406: U2.4 12.3,23.13 11.94,23.5 2.79,23.5 1.91,24.38 1.91,47.37 v2.54,48.01 | v2.54,50.8 3.75,52.01 J1.7
  Bottom 0.406: v2.54,48.01 v2.54,50.8
SPI_MOSI  (via drill 0.35)
  Top 0.406: J1.3 v6.11,47.61 v6.1,47.62 | v3.68,47.5 3.56,47.5 2.54,46.48 2.54,24.64 3.05,24.13 12.7,24.13 13.8,23.03 U2.5
  Bottom 0.406: v6.1,47.62 3.81,47.62 v3.68,47.5
VCC
  Top 0.813: L1.2 3.39,65.19 5.08,63.5 PS1.2 26.23,63.5 U4.4 | 27.94,77.09 U5.2 27.94,70.99 27.56,70.99 26.67,70.1 26.67,66.73 27.94,65.46 U4.4 | U6.2 39.37,70.99 38.99,70.61 37.34,70.61 36.79,70.06 36.79,66.44 U7.4 35.56,63.12 27.94,63.12 U4.4
  Top 1.016: IC1.4 17.48,86.79 20.83,83.44 C11.+ 20.83,78.74 21.84,77.72 27.3,77.72 27.94,77.09
VIN  (via drill 0.35)
  Top 0.813: U5.7 v34.29,76.96 | U6.7 v45.72,77.09
  Top 1.016: v16.76,81.66 16.76,81.69 IC1.1
  Top 1.27: J2.2 18.97,97.79 25.4,97.79 27.94,95.25 27.94,93.98 C10.+
  Bottom 0.813: v34.29,76.96 34.29,78.36 | v45.72,77.09 45.72,78.36
  Bottom 1.016: v16.76,81.66 26.71,81.66 26.84,81.53
  Bottom 1.27: C10.+ 26.84,81.53 26.84,80.65 26.8,80.64 29.08,78.36 34.29,78.36 45.72,78.36
  other vias: 46.99,71.25 46.99,72.77 46.99,74.04 46.99,75.31 46.99,76.71
  pour Bottom (isolate 0.406, no thermals): 45.47,71.12 48.01,71.12 48.01,78.87 45.47,78.87
  pour Top (isolate 0.406, no thermals): 45.47,71.12 48.26,71.12 48.26,78.74 45.47,78.74
  pour Top (isolate 0.406, rank 2): 15.24,99.06 29.21,99.06 29.21,90.17 13.97,90.17 13.97,99.06
  pour Bottom (isolate 0.406): 13.97,99.06 29.21,99.06 29.21,90.17 13.97,90.17
  pour Bottom (isolate 0.406): 25.4,90.17 25.4,77.47 48.26,77.47 48.26,91.44 25.4,91.44